# Altium schematic sheet IO.SchDoc
size A; SheetNumber: 3; SheetTotal: 5
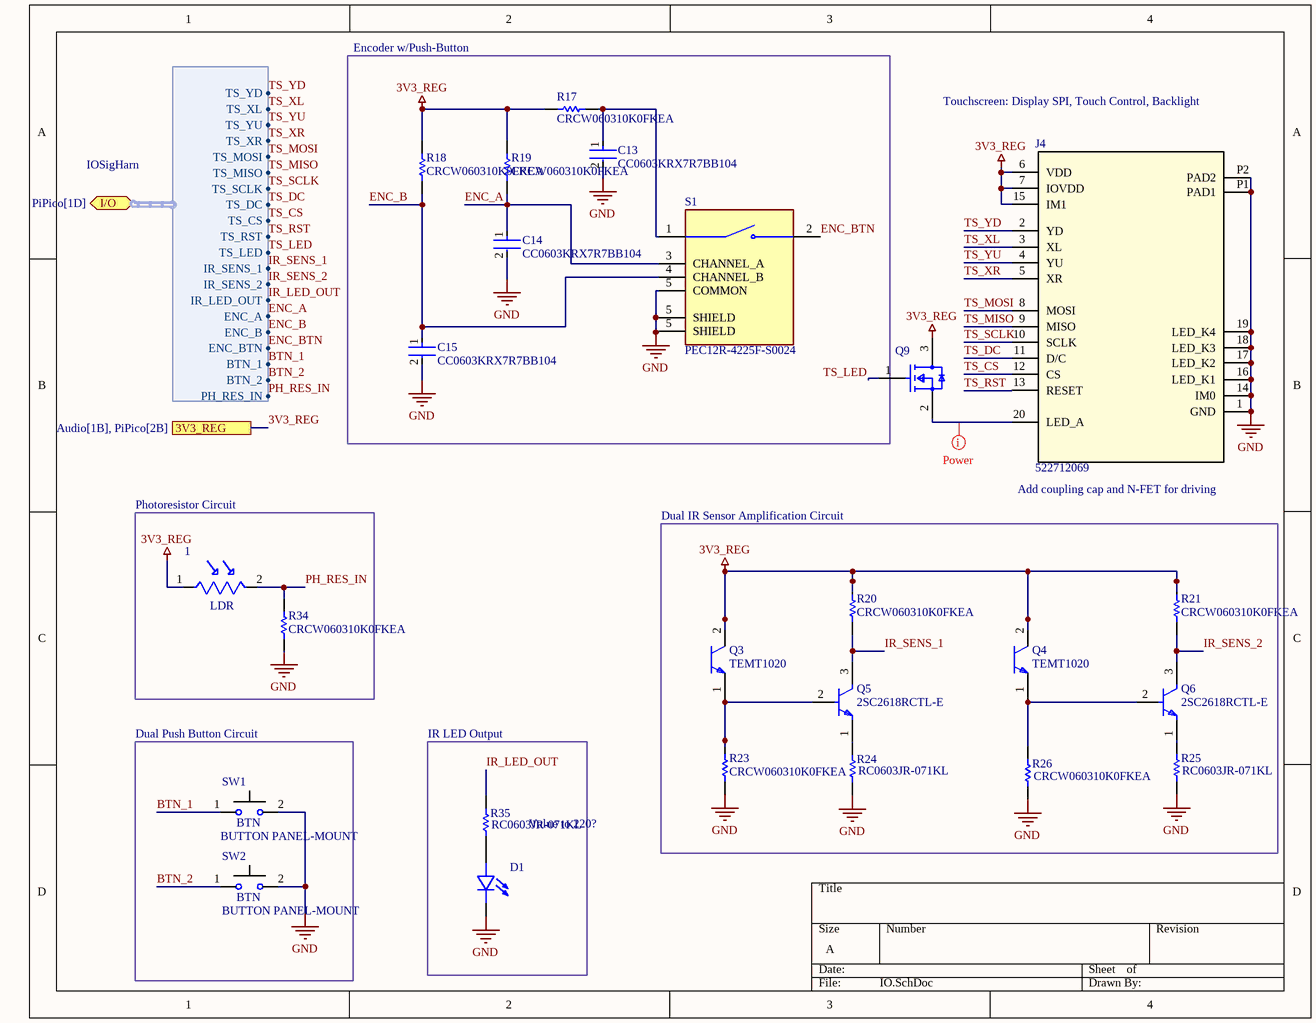
[diagram p0: IO.SchDoc]

## Parts
1  LDR  [2-pin Header (Generic)]
C13  CC0603KRX7R7BB104  [FP-CC0603-DA-MFG]
C14  CC0603KRX7R7BB104  [FP-CC0603-DA-MFG]
C15  CC0603KRX7R7BB104  [FP-CC0603-DA-MFG]
D1  (no value)  [2-pin Header (Generic)]
J4  522712069  [CON_522712069_MOL]
Q3  TEMT1020  [FP-6_544-5325_01-4-MFG]
Q4  TEMT1020  [FP-6_544-5325_01-4-MFG]
Q5  2SC2618RCTL-E  [PLSP0003ZB-A_P213_MFG]
Q6  2SC2618RCTL-E  [PLSP0003ZB-A_P213_MFG]
Q9  2N7002H6327XTSA2  [FP-PG-SOT23-3-MFG]  (value not drawn)
R17  CRCW060310K0FKEA  [RESC1609X50X30NL8T20]
R18  CRCW060310K0FKEA  [RESC1609X50X30NL8T20]
R19  CRCW060310K0FKEA  [RESC1609X50X30NL8T20]
R20  CRCW060310K0FKEA  [RESC1609X50X30NL8T20]
R21  CRCW060310K0FKEA  [RESC1609X50X30NL8T20]
R23  CRCW060310K0FKEA  [RESC1609X50X30NL8T20]
R24  RC0603JR-071KL  [RESC1608X55X25ML10T15]
R25  RC0603JR-071KL  [RESC1608X55X25ML10T15]
R26  CRCW060310K0FKEA  [RESC1609X50X30NL8T20]
R34  CRCW060310K0FKEA  [RESC1609X50X30NL8T20]
R35  RC0603JR-071KL  [RESC1608X55X25ML10T15]
S1  PEC12R-4225F-S0024  [5-pin Header (Generic)]
SW1  BUTTON PANEL-MOUNT  [2-pin Header (Generic)]
SW2  BUTTON PANEL-MOUNT  [2-pin Header (Generic)]

## Blocks framed on the sheet
Encoder w/Push-Button: C13-C15 R17-R19 S1
Photoresistor Circuit: 1 R34
Dual IR Sensor Amplification Circuit: Q3-Q6 R20 R21 R23-R26
Dual Push Button Circuit: SW1 SW2

## Ports
3V3_REG (see Audio[1B], PiPico[2B]), I/O (bidir, harness IOSigHarn, see PiPico[1D])

## Harnesses
IOSigHarn: TS_YD, TS_XL, TS_YU, TS_XR, TS_MOSI, TS_MISO, TS_SCLK, TS_DC, TS_CS, TS_RST, TS_LED, IR_SENS_1, IR_SENS_2, IR_LED_OUT, ENC_A, ENC_B, ENC_BTN, BTN_1, BTN_2, PH_RES_IN

## Nets
3V3_REG: 1.1 J4.6(VDD) J4.7(IOVDD) J4.15(IM1) Q3.2(C) Q4.2(C) Q9.3(drain) R17.2 R18.2 R19.2 R20.2 R21.2 ; port 3V3_REG
GND: C13.2 C14.2 C15.2 D1.1(C) J4.1(GND) J4.14(IM0) J4.16(LED_K1) J4.17(LED_K2) J4.18(LED_K3) J4.19(LED_K4) J4.P1(PAD1) J4.P2(PAD2) R23.1 R24.1 R25.1 R26.1 R34.1 S1.5(COMMON) SW1.2 SW2.2
BTN_1: SW1.1 ; port I/O.BTN_1
BTN_2: SW2.1 ; port I/O.BTN_2
ENC_A: C14.1 R19.1 S1.3(CHANNEL_A) ; port I/O.ENC_A
ENC_B: C15.1 R18.1 S1.4(CHANNEL_B) ; port I/O.ENC_B
ENC_BTN: S1.2 ; port I/O.ENC_BTN
IR_LED_OUT: R35.2 ; port I/O.IR_LED_OUT
IR_SENS_1: Q5.3(COLLECTOR) R20.1 ; port I/O.IR_SENS_1
IR_SENS_2: Q6.3(COLLECTOR) R21.1 ; port I/O.IR_SENS_2
PH_RES_IN: 1.2 R34.2 ; port I/O.PH_RES_IN
TS_CS: J4.12(CS) ; port I/O.TS_CS
TS_DC: J4.11(D/C) ; port I/O.TS_DC
TS_LED: Q9.1(gate) ; port I/O.TS_LED
TS_MISO: J4.9(MISO) ; port I/O.TS_MISO
TS_MOSI: J4.8(MOSI) ; port I/O.TS_MOSI
TS_RST: J4.13(RESET) ; port I/O.TS_RST
TS_SCLK: J4.10(SCLK) ; port I/O.TS_SCLK
TS_XL: J4.3(XL) ; port I/O.TS_XL
TS_XR: J4.5(XR) ; port I/O.TS_XR
TS_YD: J4.2(YD) ; port I/O.TS_YD
TS_YU: J4.4(YU) ; port I/O.TS_YU
NetC13_1: C13.1 R17.1 S1.1
NetD1_2: D1.2(A) R35.1
NetJ4_20: J4.20(LED_A) Q9.2(source)
NetQ3_1: Q3.1(E) Q5.2(BASE) R23.2
NetQ4_1: Q4.1(E) Q6.2(BASE) R26.2
NetQ5_1: Q5.1(EMITTER) R24.2
NetQ6_1: Q6.1(EMITTER) R25.2

## Layout directives
net class POWER: NetJ4_20

## Notes on the sheet
- Touchscreen: Display SPI, Touch Control, Backlight
- Add coupling cap and N-FET for driving
- IR LED Output
- Value to 220?
- (in symbol BUTTON PANEL-MOUNT) BTN

## Library data of the parts
1 = PHOTORESISTOR GENERIC: Generic Photoresistor symbol for peripheral use. / Uses generic 2-Pin Header footprint.
C13-C15 = CMP-2000-05002-2: CAP CER 0.1UF 16V X7R 0603; Manufacturer: YAGEO; Tolerance: 0.1; Value: 100 nF; Temperature Coefficient: 15%; Material: Ceramic; Voltage Rating: 16 V; Package: CC0603-DA; ComponentLink2Description: Datasheet; Octopart: https://octopart.com/cc0603krx7r7bb104-yageo-192941; Temperature Range High: +125°C; Digikey Description: CAP CER 0.1UF 16V X7R 0603; Voltage: 16 V; Device Class L2: Capacitors; Height: 0.9mm; Temperature: -55°C to +125°C; Manufacturer Part Number: CC0603KRX7R7BB104; Device Class L1: Passive Components; Device Class L3: Ceramic Capacitors; ComponentLink2URL: http://www.yageo.com/documents/recent/UPY-GPHC_X7R_6.3V-to-50V_18.pdf; Footprint Url: http://www.yageo.com/exep/pages/download/literatures/UPY-C_GEN_24.pdf; RoHS: TRUE; Temperature Range Low: -55°C; Temperature Characteristic: X7R; Lead Free: Yes; Capacitance: 100 nF; Category: Cap; Mouser Description: Multilayer Ceramic Capacitor, CC Series, 0.1 - F, - 10%, X7R, 16 V, 0603 [1608 Metric]; Automotive: No
D1 = APT1608SF4C-PRV: IR_LED; MF: {'manufacturer': u'Kingbright'}; Package: None; Price: None; Value: *; MP: APT1608SF4C-PRV; Availability: Unavailable
J4 = 522712069: Mfr_Name: Molex Connector Corporation; RefDes: RefDes; Type: Type
Q3 Q4 = CMP-02533-000001-1: SENSOR PHOTO 880NM TOP VIEW 2SMD; Manufacturer: Vishay Semiconductor Opto Division; Viewing Angle: 30°; Operating Supply Current: 7mA; Standoff Height: 0.08mm; Power Dissipation: 100mW; Max Junction Temp: +100°C; Collector Emitter Breakdown Voltage: 70V; Dark Current: 0.001uA; Max Collector Current: 50mA; Device Class L2: Optical Sensors; Package: 6.544-5325.01-4; ComponentLink2URL: http://www.vishay.com/doc?81554; Device Class L3: Phototransistor; Device Class L1: Sensors; Temperature: to +100°C; RoHS: TRUE; Temperature Range High: +100°C; Wavelength: 880nm; Lead Free: Yes; ComponentLink2Description: Datasheet; Category: Trans; Digikey Description: SENSOR PHOTO 880NM TOP VIEW 2SMD; Ambient Temperature Range Low: -40°C; Mouser Description: Phototransistors NPN Phototransistor; Automotive: No; Ambient Temperature Range High: +85°C; Octopart: https://octopart.com/temt1020-vishay-39666707; Manufacturer Part Number: TEMT1020; Led Orientation: Top View; Height: 2.98mm
Q5 Q6 = CMP-00572-10406399-1: Trans Gp Bjt NPN 35V 0.5A 3-PIN Mpak T/r; Manufacturer Lifecycle Status: OBSOLETE; Power Dissipation: 150mW; Emitter Base Voltage (VEBO): 4V; Number of Elements: 1; ComponentLink1Description: Manufacturer's Website; Max Operating Temperature: 150°C; Lead Free: Lead Free; ComponentLink1URL: http://www.renesas.com; China RoHS: Compliant; ComponentLink2Description: Datasheet URL; Polarity: NPN; ComponentLink3Description: Manufacturer's Package Drawing; ComponentLink3URL: https://www.renesas.com/en/document/psc/package-drawing-mpak-3pin-plsp0003zb; Width: 3mm; Min Operating Temperature: -55°C; Length: 2mm; Height: 1.3mm; Collector Emitter Voltage (VCEO): 35V; Mount: Surface Mount; Number of Pins: 3; Collector Base Voltage (VCBO): 35V; RoHS: Compliant; Radiation Hardening: No; HelpURL: https://octopart.com/cad-content/api/get-model-datasheet/15189/10406399; Lifecycle Status: Obsolete; ComponentLink2URL: https://octopart.com/cad-content/api/get-model-datasheet/15189/10406399
Q9 = CMP-32901-000180-1: MOSFET N-CH 60V 0.3A SOT23; Rise Time: 3.3ns; Input Capacitance: 20pF; Rds On Max: 3R; Gate to Source Voltage (Vgs): 20V; Continuous Drain Current (ID): 300mA; Max Power Dissipation: 500mW; Packaging: Tape and Reel; Mount: Surface Mount; Case/Package: SOT-23; Drain to Source Voltage (Vdss): 60V; Min Operating Temperature: -55°C; Halogen Free: Halogen Free; Max Dual Supply Voltage: 60V; Number of Pins: 3; Lead Free: Lead Free; Max Operating Temperature: 150°C
R17-R21 R23 R26 R34 = CMP-1666-00005-4: Chip Resistor, 10 KOhm, +/- 1%, 100 mW, -55 to 155 degC, 0603 (1608 Metric), RoHS, Tape and Reel; Manufacturer: Vishay Semiconductor; Voltage Rating: 75 V; Max Operating Temperature: 155 degC; PackageDescription: 2-Pin Surface Mount Device, Body 1.575 x 0.85 mm; ComponentLink1Description: Manufacturer URL; RoHSCompliant: true; PackageReference: 0603; REACH SVHC: Unknown; Length: 1.55 mm; DatasheetVersion: 06/2012; Packaging: Tape and Reel; Min Operating Temperature: -55 degC; Mounting Technology: Surface Mount; ComponentLink2URL: https://datasheet.ciiva.com/11809/0900766b80d98afc-11809037.pdf; Height: 0.45 mm; ComponentLink2Description: Datasheet; Package Quantity: 5000; ComponentLink1URL: http://www.vishay.com/
R24 R25 R35 = CMP-2000-05023-1: Chip Resistor, 1 KOhm, +/- 5%, 0.063 W, -55 to 155 degC, 0603 (1608 Metric), RoHS, Tape and Reel; Manufacturer: Yageo; Resistor Case Style: 0603[1608Metric]; Resistor Element Type: ThickFilm; Product Range: RCSeries; Resistance: 1kohm; SVHC: ToBeAdvised; Voltage Rating: 50V; Temperature Coefficient: ±100ppm/degC; Power Rating: 100mW; Packaging: CutTape; Manufacturer URL: http://www.yageo.com/; Resistance Tolerance: ±5%; Datasheet Version: Rev. 4, 04/2009; MSL: MSL1-Unlimited; Package Description: 2-Pin Surface Mount Device, Body 1.6 x 0.8 mm; Automotive Qualification Standard: -; Package Reference: 603; Datasheet URL: https://datasheet.ciiva.com/2452/pyu-rc0603-51-rohs-l-4-2452848.pdf
S1 = PEC12R-4225F-S0024: 24 Pulse Incremental Mechanical Rotary Encoder w/ 6 mm Flat Shaft,Through Hole | Bourns PEC12R-4225F-S0024; SnapEDA_Link: https://www.snapeda.com/parts/PEC12R-4225F-S0024/Bourns/view-part/?ref=snap; Package: None; Value: *; MF: Bourns; MP: PEC12R-4225F-S0024; Check_prices: https://www.snapeda.com/parts/PEC12R-4225F-S0024/Bourns/view-part/?ref=eda